# EAGLE schematic aardvark-v0.80 (EAGLE 9.6.2)

## Sheet 1 of 2
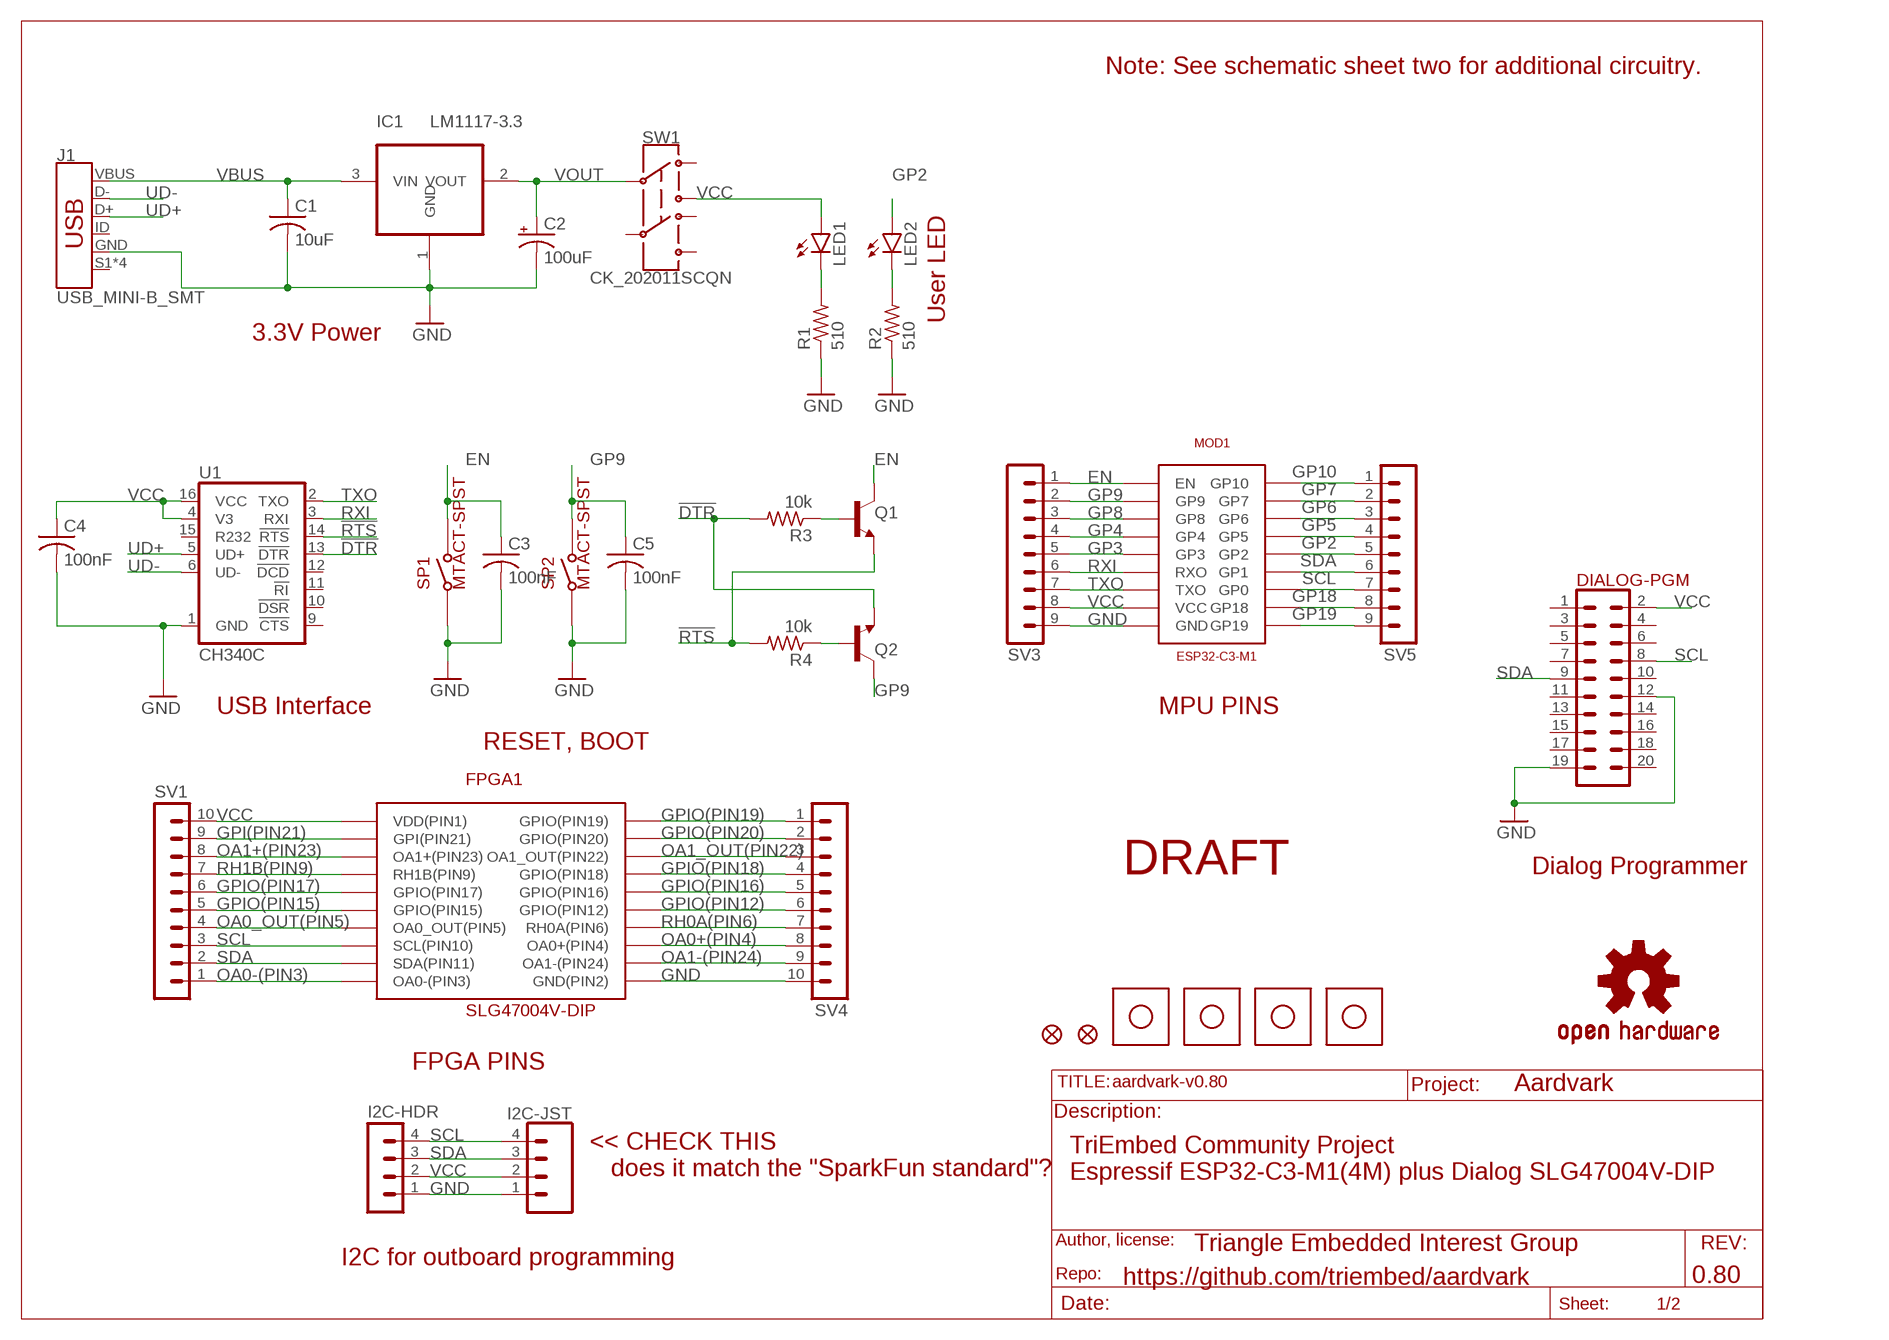
[diagram p0: schematic, sheet 1]

### Parts
C1  10uF  C-USC0805  [C0805]
C2  100uF  47UF-POLAR-PANASONIC_D-50V-20%  [PANASONIC_D]
C3  100nF  C-USC0805  [C0805]
C4  100nF  C-USC0805  [C0805]
C5  100nF  C-USC0805  [C0805]
DIALOG-PGM  CONN_10X2  [2X10]
FD1  FIDUCIAL1X2  [FIDUCIAL-1X2]
FD2  FIDUCIAL1X2  [FIDUCIAL-1X2]
FPGA1  SLG47004V-DIP  SLG47004V_DIP  [SLG47004V-DIP]
I2C-HDR  MA04-1  [MA04-1]
I2C-JST  CONN_04JST-PTH  [JST-4-PTH]
IC1  LM1117-3.3  REG1117  [SOT223]
J1  USB_MINI-B_SMT  [USB-MINIB]
LED1  LEDCHIP-LED0805  [CHIP-LED0805]
LED2  LEDCHIP-LED0805  [CHIP-LED0805]
LOGO1  OSHW-LOGOMINI  [OSHW-LOGO-MINI]
MOD1  ESP32-C3-M1  AITHINKER-C3-M1  [AITHINKER-C3-M1]
MT1  3.2-MOUNT  [3.2-MOUNT]
MT2  3.2-MOUNT  [3.2-MOUNT]
MT3  3.2-MOUNT  [3.2-MOUNT]
MT4  3.2-MOUNT  [3.2-MOUNT]
Q1  TRANS_NPN-MMBT2222AL  [SOT23-3]
Q2  TRANS_NPN-MMBT2222AL  [SOT23-3]
R1  510  R-US_R0805  [R0805]
R2  510  R-US_R0805  [R0805]
R3  10k  R-US_R0805  [R0805]
R4  10k  R-US_R0805  [R0805]
SP1  MTACT-SPST  [MTACTSPST]
SP2  MTACT-SPST  [MTACTSPST]
SV1  MA10-1  [MA10-1]
SV3  MA09-1  [MA09-1]
SV4  MA10-1  [MA10-1]
SV5  MA09-1  [MA09-1]
SW1  CK_202011SCQN  [CK_JS202011SCQN]
U1  CH340C  [SO016]

### Nets
!DTR: Q2.2(E) R3.2 U1.13(!DTR)
!RTS: Q1.2(E) R4.2 U1.14(!RTS)
EN: C3.1 MOD1.PIN1(EN) Q1.3(C) SP1.PAD2(PIN2) SV3.1
GND [power]: C1.2 C2.- C3.2 C4.2 C5.2 DIALOG-PGM.12 DIALOG-PGM.19 FPGA1.11(GND(PIN2)) I2C-HDR.1 I2C-JST.1 IC1.1(GND) J1.GND MOD1.PIN9(GND) R1.1 R2.1 SP1.PAD1(PIN1) SP2.PAD1(PIN1) SV3.9 SV4.10 U1.1(GND)
GP2: LED2.A MOD1.PIN14(GP2) SV5.5
GP3: MOD1.PIN5(GP3) SV3.5
GP4: MOD1.PIN4(GP4) SV3.4
GP5: MOD1.PIN15(GP5) SV5.4
GP6: MOD1.PIN16(GP6) SV5.3
GP7: MOD1.PIN17(GP7) SV5.2
GP8: MOD1.PIN3(GP8) SV3.3
GP9: C5.1 MOD1.PIN2(GP9) Q2.3(C) SP2.PAD2(PIN2) SV3.2
GP10: MOD1.PIN18(GP10) SV5.1
GP18: MOD1.PIN11(GP18) SV5.8
GP19: MOD1.PIN10(GP19) SV5.9
GPI(PIN21): FPGA1.2(GPI(PIN21)) SV1.9
GPIO(PIN12): FPGA1.15(GPIO(PIN12)) SV4.6
GPIO(PIN15): FPGA1.6(GPIO(PIN15)) SV1.5
GPIO(PIN16): FPGA1.16(GPIO(PIN16)) SV4.5
GPIO(PIN17): FPGA1.5(GPIO(PIN17)) SV1.6
GPIO(PIN18): FPGA1.17(GPIO(PIN18)) SV4.4
GPIO(PIN19): FPGA1.20(GPIO(PIN19)) SV4.1
GPIO(PIN20): FPGA1.19(GPIO(PIN20)) SV4.2
N$1: LED2.C R2.2
N$3: LED1.C R1.2
N$10: Q1.1(B) R3.1
N$11: Q2.1(B) R4.1
OA0+(PIN4): FPGA1.13(OA0+(PIN4)) SV4.8
OA0-(PIN3): FPGA1.10(OA0-(PIN3)) SV1.1
OA0_OUT(PIN5): FPGA1.7(OA0_OUT(PIN5)) SV1.4
OA1+(PIN23): FPGA1.3(OA1+(PIN23)) SV1.8
OA1-(PIN24): FPGA1.12(OA1-(PIN24)) SV4.9
OA1_OUT(PIN22): FPGA1.18(OA1_OUT(PIN22)) SV4.3
RH0A(PIN6): FPGA1.14(RH0A(PIN6)) SV4.7
RH1B(PIN9): FPGA1.4(RH1B(PIN9)) SV1.7
RXI: MOD1.PIN6(RXO) SV3.6 U1.3(RXI)
SCL: DIALOG-PGM.8 FPGA1.8(SCL(PIN10)) I2C-HDR.4 I2C-JST.4 MOD1.PIN12(GP0) SV1.3 SV5.7
SDA: DIALOG-PGM.9 FPGA1.9(SDA(PIN11)) I2C-HDR.3 I2C-JST.3 MOD1.PIN13(GP1) SV1.2 SV5.6
TXO: MOD1.PIN7(TXO) SV3.7 U1.2(TXO)
UD+: J1.D+ U1.5(UD+)
UD-: J1.D- U1.6(UD-)
VBUS [power]: C1.1 IC1.3(VIN) J1.VBUS
VCC [power]: C4.1 DIALOG-PGM.2 FPGA1.1(VDD(PIN1)) I2C-HDR.2 I2C-JST.2 LED1.A MOD1.PIN8(VCC) SV1.10 SV3.8 SW1.1-NO U1.4(V3) U1.16(VCC)
VOUT [power]: C2.+ IC1.2(VOUT) SW1.1-C(C1)
Unconnected: DIALOG-PGM.1 DIALOG-PGM.3 DIALOG-PGM.4 DIALOG-PGM.5 DIALOG-PGM.6 DIALOG-PGM.7 DIALOG-PGM.10 DIALOG-PGM.11 DIALOG-PGM.13 DIALOG-PGM.14 DIALOG-PGM.15 DIALOG-PGM.16 DIALOG-PGM.17 DIALOG-PGM.18 DIALOG-PGM.20 J1.ID J1.S1(SHIELD) J1.S2(SHIELD) J1.S3(SHIELD) J1.S4(SHIELD) SW1.1-NC SW1.2-C(C2) SW1.2-NC SW1.2-NO U1.9(!CTS) U1.10(!DSR) U1.11(!RI) U1.12(!DCD) U1.15(R232)

### Notes on the sheet
- Note: See schematic sheet two for additional circuitry.
- User LED
- 3.3V Power
- USB Interface | MPU PINS
- RESET, BOOT
- DRAFT | Dialog Programmer
- FPGA PINS
- Aardvark
- << CHECK THIS
     does it match the "SparkFun standard"?
- TriEmbed Community Project
  Espressif ESP32-C3-M1(4M) plus Dialog SLG47004V-DIP
- Triangle Embedded Interest Group
- I2C for outboard programming
- https://github.com/triembed/aardvark | 0.80

## Sheet 2 of 2
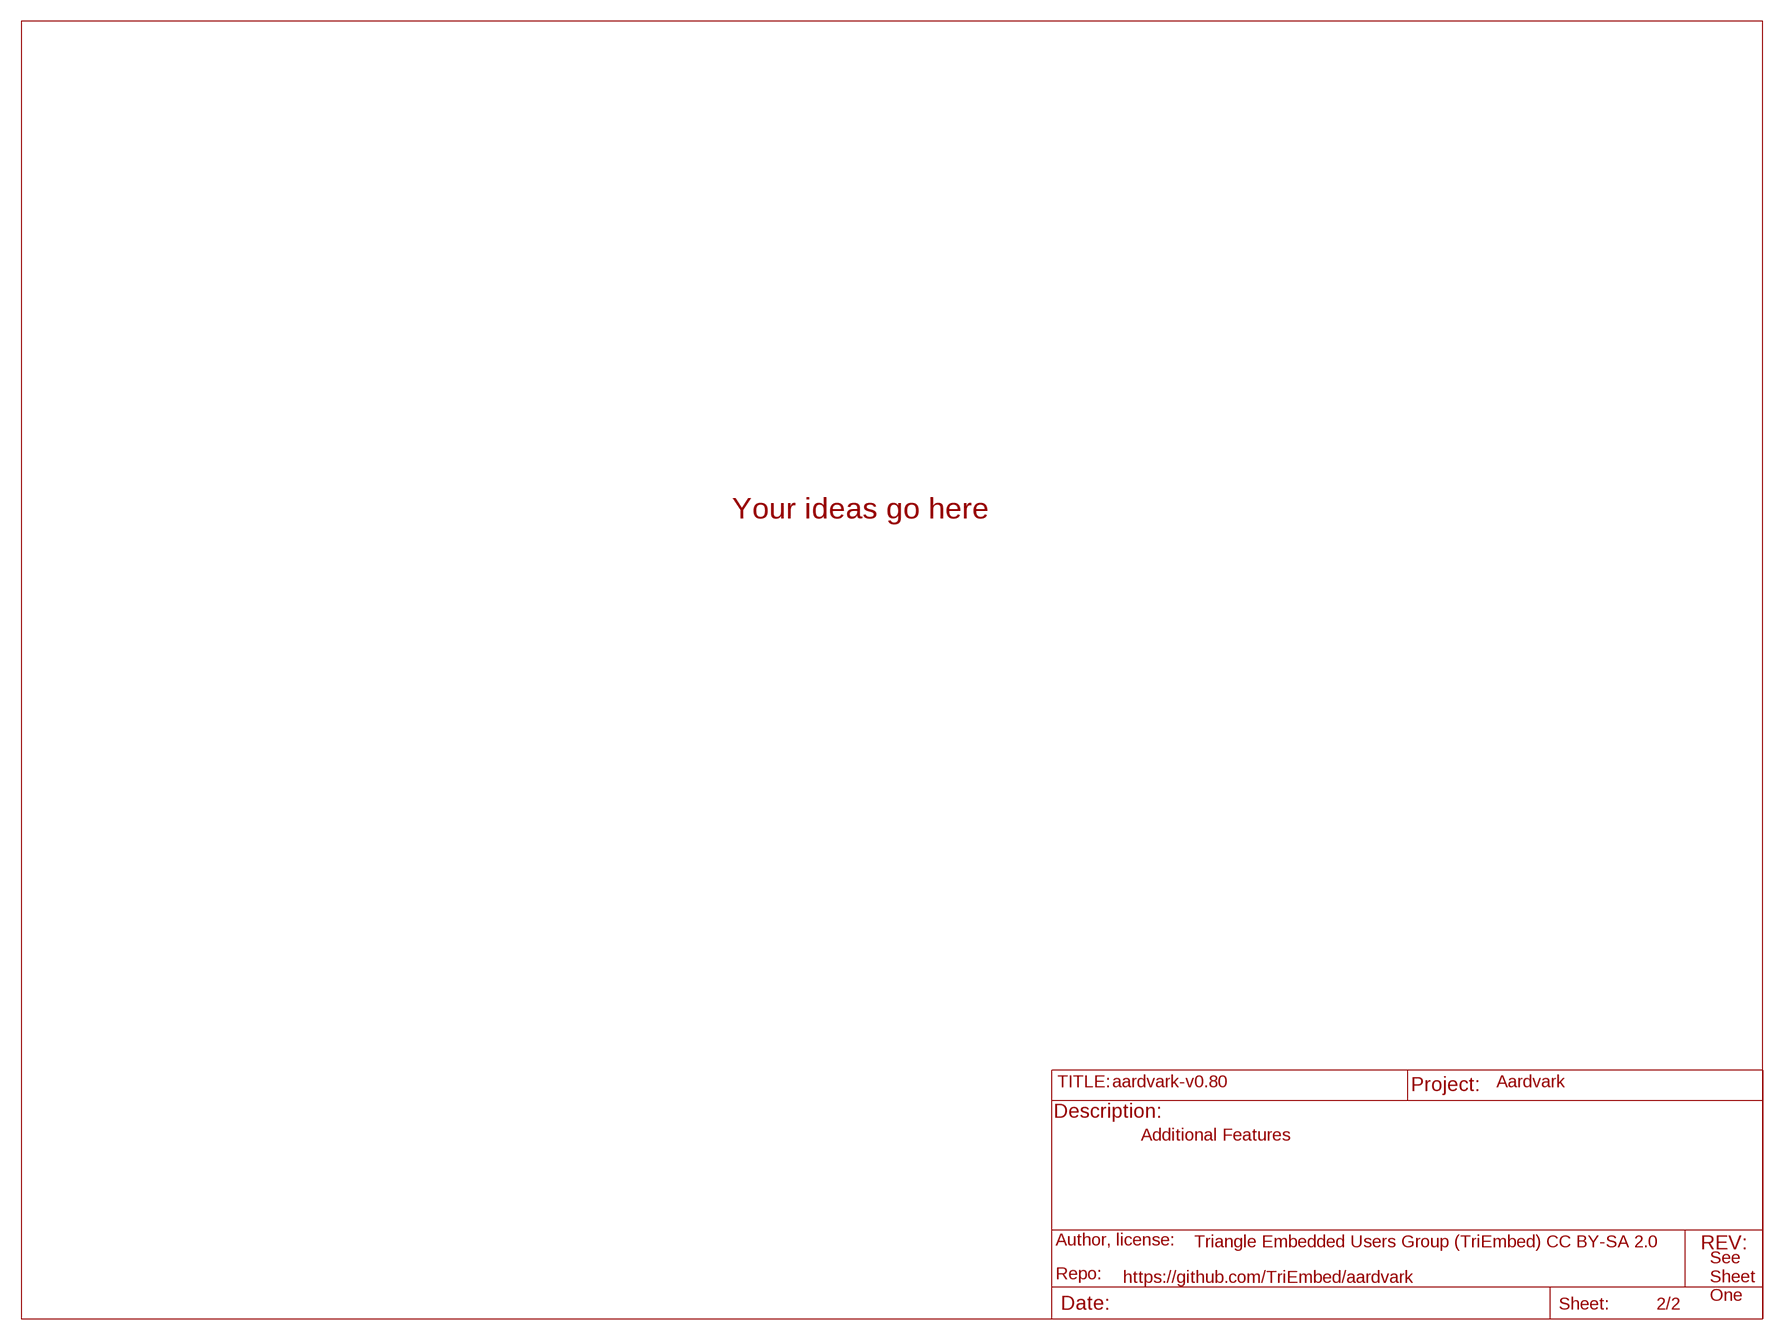
[diagram p1: schematic, sheet 2]

### Notes on the sheet
- Your ideas go here
- Aardvark
- Additional Features
- Triangle Embedded Users Group (TriEmbed) CC BY-SA 2.0
- https://github.com/TriEmbed/aardvark
- See
  Sheet
  One

## Library data of the parts
C1 C3-C5 = rcl:C-US: CAPACITOR, American symbol; SPICEPREFIX: C
C2 = SparkFun-Capacitors:47UF-POLAR: 47µF polarized capacitors A capacitor is a passive two-terminal electrical component used to store electrical energy temporarily in an electric field.
DIALOG-PGM = SparkFun-Connectors:CONN_10X2: Multi connection point. Often used as Generic Header-pin footprint for 0.1 inch spaced/style header connections On any of the 0.1 inch spaced packages, you can populate with these: Break Away Headers - Straight <https://www.sparkfun.com/products/116> (PRT-00116) Break Away Male Headers - Right Angle <https://www.sparkfun.com/products/553> (PRT-00553) Female Headers <https://www.sparkfun.com/products/115> (PRT-00115) Break Away Headers - Machine Pin <https://www.sparkfun.com/products/117> (PRT-00117) Break Away Female Headers - Swiss Machine Pin <https://www.sparkfun.com/products/743> (PRT-00743) Special note about the "SPECIAL" package: This was SPECIALLY designed to be used with our Graphic LCD Backpack. Be sure you want to use this! It is not only staggered on each line of header holes, but IT IS ALSO offset of the center point of the top and bottom lines by 5 mil. This causes the headers to lock into place on the "standard" footprint on the LCD screen. The extra squares on the tdocu layer are there simply to reference other pins (if you were to actually populate a longer header than ten long - this is what we do with the backpacks).
FD1 FD2 = apexprotofactory:FIDUCIAL: Fiducial Alignment Points Derived from SparkFun library but with cream (paste) included in pad. This is necessary for stencil creation by OSH Stencils!!
FPGA1 = SLG47004V-DIP:SLG47004V_DIP
I2C-HDR = con-lstb:MA04-1: PIN HEADER; OC_FARNELL: unknown; OC_NEWARK: unknown
I2C-JST = SparkFun-Connectors:CONN_04: Multi connection point. Often used as Generic Header-pin footprint for 0.1 inch spaced/style header connections On any of the 0.1 inch spaced packages, you can populate with these: Break Away Headers - Straight <https://www.sparkfun.com/products/116> (PRT-00116) Break Away Male Headers - Right Angle <https://www.sparkfun.com/products/553> (PRT-00553) Female Headers <https://www.sparkfun.com/products/115> (PRT-00115) Break Away Headers - Machine Pin <https://www.sparkfun.com/products/117> (PRT-00117) Break Away Female Headers - Swiss Machine Pin <https://www.sparkfun.com/products/743> (PRT-00743) For SCREWTERMINALS and SPRING TERMINALS visit here: Screw Terimnals on SparkFun.com <https://www.sparkfun.com/search/results?term=Screw+Terminals> (5mm/3.5mm/2.54mm spacing) This device is also useful as a general connection point to wire up your design to another part of your project. Our various solder wires solder well into these plated through hole pads. Hook-Up Wire - Assortment (Stranded, 22 AWG) <https://www.sparkfun.com/products/11375> (PRT-11375) Hook-Up Wire - Assortment (Solid Core, 22 AWG) <https://www.sparkfun.com/products/11367> (PRT-11367) View the entire wire category on our website here <https://www.sparkfun.com/categories/141> Special notes: Molex polarized connector foot print use with SKU : PRT-08231 with associated crimp pins and housings. 1MM SMD Version SKU: PRT-10208; PROD_ID: WIRE-13531; SF_ID: PRT-09916
IC1 = burr-brown:REG1117: 800mA and 1A Low Dropout (LDO) Positive Regulator 1.8V, 2.5V, 2.85V, 3.3V, 5V, and Adj; MPN: REG1117; OC_FARNELL: 1097566; OC_NEWARK: 14P6981
J1 = SparkFun-Connectors:USB_MINI-B: USB type Mini-B Connector Breaks out 5th pin, and includes shield pins if needed. SparkFun Products: SparkFun FTDI Basic Breakout <https://www.sparkfun.com/products/9716> SparkFun XBee Explorer USB <https://www.sparkfun.com/products/11812> SparkFun Redboard <https://www.sparkfun.com/products/12757>; PROD_ID: CONN-08193; SF_ID: PRT-00587
LED1 LED2 = led:LED: LED OSRAM: - CHIPLED LG R971, LG N971, LY N971, LG Q971, LY Q971, LO R971, LY R971 LH N974, LH R974 LS Q976, LO Q976, LY Q976 LO Q996 - Hyper CHIPLED LW Q18S LB Q993, LB Q99A, LB R99A - SideLED LS A670, LO A670, LY A670, LG A670, LP A670 LB A673, LV A673, LT A673, LW A673 LH A674 LY A675 LS A676, LA A676, LO A676, LY A676, LW A676 LS A679, LY A679, LG A679 - Hyper Micro SIDELED® LS Y876, LA Y876, LO Y876, LY Y876 LT Y87S - SmartLED LW L88C, LW L88S LB L89C, LB L89S, LG L890 LS L89K, LO L89K, LY L89K LS L896, LA L896, LO L896, LY L896 - TOPLED LS T670, LO T670, LY T670, LG T670, LP T670 LSG T670, LSP T670, LSY T670, LOP T670, LYG T670 LG T671, LOG T671, LSG T671 LB T673, LV T673, LT T673, LW T673 LH T674 LS T676, LA T676, LO T676, LY T676, LB T676, LH T676, LSB T676, LW T676 LB T67C, LV T67C, LT T67C, LS T67K, LO T67K, LY T67K, LW E67C LS E67B, LA E67B, LO E67B, LY E67B, LB E67C, LV E67C, LT E67C LW T67C LS T679, LY T679, LG T679 LS T770, LO T770, LY T770, LG T770, LP T770 LB T773, LV T773, LT T773, LW T773 LH T774 LS E675, LA E675, LY E675, LS T675 LS T776, LA T776, LO T776, LY T776, LB T776 LHGB T686 LT T68C, LB T68C - Hyper Mini TOPLED® LB M676 - Mini TOPLED Santana® LG M470 LS M47K, LO M47K, LY M47K Source: http://www.osram.convergy.de LUXEON: - LUMILED® LXK2-PW12-R00, LXK2-PW12-S00, LXK2-PW14-U00, LXK2-PW14-V00 LXK2-PM12-R00, LXK2-PM12-S00, LXK2-PM14-U00 LXK2-PE12-Q00, LXK2-PE12-R00, LXK2-PE12-S00, LXK2-PE14-T00, LXK2-PE14-U00 LXK2-PB12-K00, LXK2-PB12-L00, LXK2-PB12-M00, LXK2-PB14-N00, LXK2-PB14-P00, LXK2-PB14-Q00 LXK2-PR12-L00, LXK2-PR12-M00, LXK2-PR14-Q00, LXK2-PR14-R00 LXK2-PD12-Q00, LXK2-PD12-R00, LXK2-PD12-S00 LXK2-PH12-R00, LXK2-PH12-S00 LXK2-PL12-P00, LXK2-PL12-Q00, LXK2-PL12-R00 Source: www.luxeon.com KINGBRIGHT: KA-3528ASYC Source: www.kingbright.com
LOGO1 = SparkFun-Aesthetics:OSHW-LOGO: Open-Source Hardware (OSHW) Logo This logo indicates the piece of hardware it is found on incorporates a OSHW license and/or adheres to the definition of open source hardware found here: http://freedomdefined.org/OSHW
MOD1 = aithinker-C3-M1:AITHINKER-C3-M1: ESPRESSIF ESP32 C3 M1 module from AI Thinker
MT1-MT4 = apexprotofactory:3.2-MOUNT
Q1 Q2 = SparkFun-DiscreteSemi:TRANS_NPN: NPN transistor Current controlled devices typically used to amplify current or used as a switch. BC547 - COM-08928 <http://www.sparkfun.com/products/8928> (TO-92 45V 100mA) (1.Collector 2.Base 3.Emitter) 2N3904 - COM-00521 <http://www.sparkfun.com/products/521> (TO-92 40V 200mA) (1.Emitter 2.Base 3.Collector) P2N2222A - COM-12852 <http://www.sparkfun.com/products/12852> (TO-92 40V 600mA) (1.Collector 2.Base 3.Emitter); PROD_ID: TRANS-08049; VALUE: 600mA/40V
R1-R4 = rcl:R-US_: RESISTOR, American symbol; SPICEPREFIX: R
SP1 SP2 = CK-ATS2D1G_NC_LFS:MTACT-SPST: C&K ATS series momentary contact SPST pushbutton switch
SV1 SV4 = con-lstb:MA10-1: PIN HEADER; OC_FARNELL: unknown; OC_NEWARK: unknown
SV3 SV5 = con-lstb:MA09-1: PIN HEADER; OC_FARNELL: unknown; OC_NEWARK: unknown
SW1 = CK_JS202011SCQN:CK_202011SCQN
U1 = SparkFun-IC-Comms:CH340C; PROD_ID: IC-14038

## Net classes
0 default: width 0.203 mm
1 power: width 0.508 mm